# Altium schematic sheet CATS-FAT-Mageto.SchDoc: CATS Pro
size A4; Author: Luca Jost; Revision: 1.0; SheetNumber: 13; SheetTotal: 13; Subtitle: Magnetometer
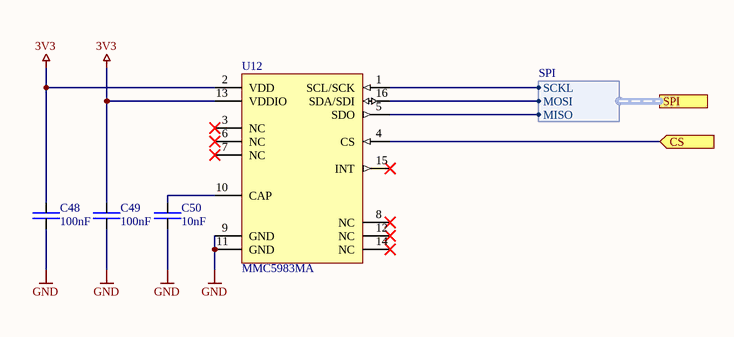
[diagram p0: CATS-FAT-Mageto.SchDoc]

## Parts
C48  100nF  [SMD Keramikkondensator 0603]
C49  100nF  [SMD Keramikkondensator 0603]
C50  10nF  [SMD Keramikkondensator 0603]
U12  MMC5983MA  [SMD IC LGA-16 4/4]

## Ports
CS (in), SPI (harness SPI)

## Harnesses
SPI: SCKL, MOSI, MISO

## Nets
3V3: C48.2 C49.2 U12.2(VDD) U12.13(VDDIO)
GND: C48.1 C49.1 C50.1 U12.9(GND) U12.11(GND)
CS: U12.4(CS) ; port CS
NetC50_2: C50.2 U12.10(CAP)
NetU12_1: U12.1(SCL/SCK) ; port SPI.SCKL
NetU12_5: U12.5(SDO) ; port SPI.MISO
NetU12_16: U12.16(SDA/SDI) ; port SPI.MOSI

Not connected (* = marked no-connect by the designer): U12 3(NC)* 6(NC)* 7(NC)* 8(NC)* 12(NC)* 14(NC)* 15(INT)*

## Notes on the sheet
- Title
- Author:
- Subtitle
- Date:
- Rev:
- CATS
- Sheet
- of
- File:

## Library data of the parts
C48 C49 = E6 - 100nF: SMD Ceramic Capacitor E6; Unit Price: 0.01; Number: -; Supplier: -
C50 = E6 - 10nF: SMD Ceramic Capacitor E6; Unit Price: 0.01; Number: -; Supplier: -
U12 = MMC5983MA: High Performance / 3-axis Magnetic Sensor; ComponentLink1Description: Datasheet; ComponentLink1URL: https://media.digikey.com/pdf/Data%20Sheets/MEMSIC%20PDFs/MMC5983MA_RevA_4-3-19.pdf; Digikey: 1267-MMC5983MACT-ND